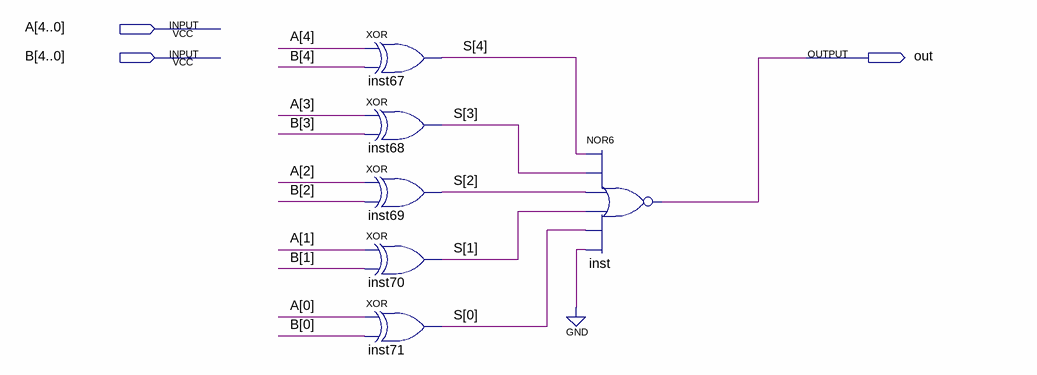
[diagram p0: schematic sheet]
// Quartus schematic Equal5.bdf as structural Verilog: 6 symbols, 3 pins
module Equal5 (
  input  [4:0] A,
  input  [4:0] B,
  output out
);

  wire [4:0] S;

  xor inst67 (S[4], A[4], B[4]);
  xor inst68 (S[3], A[3], B[3]);
  xor inst69 (S[2], A[2], B[2]);
  xor inst70 (S[1], A[1], B[1]);
  xor inst71 (S[0], A[0], B[0]);
  nor inst (out, S[4], S[3], S[2], S[1], S[0], 1'b0);
endmodule
